# Altium schematic sheet OMODRI_QuadEnc.SchDoc
size A4
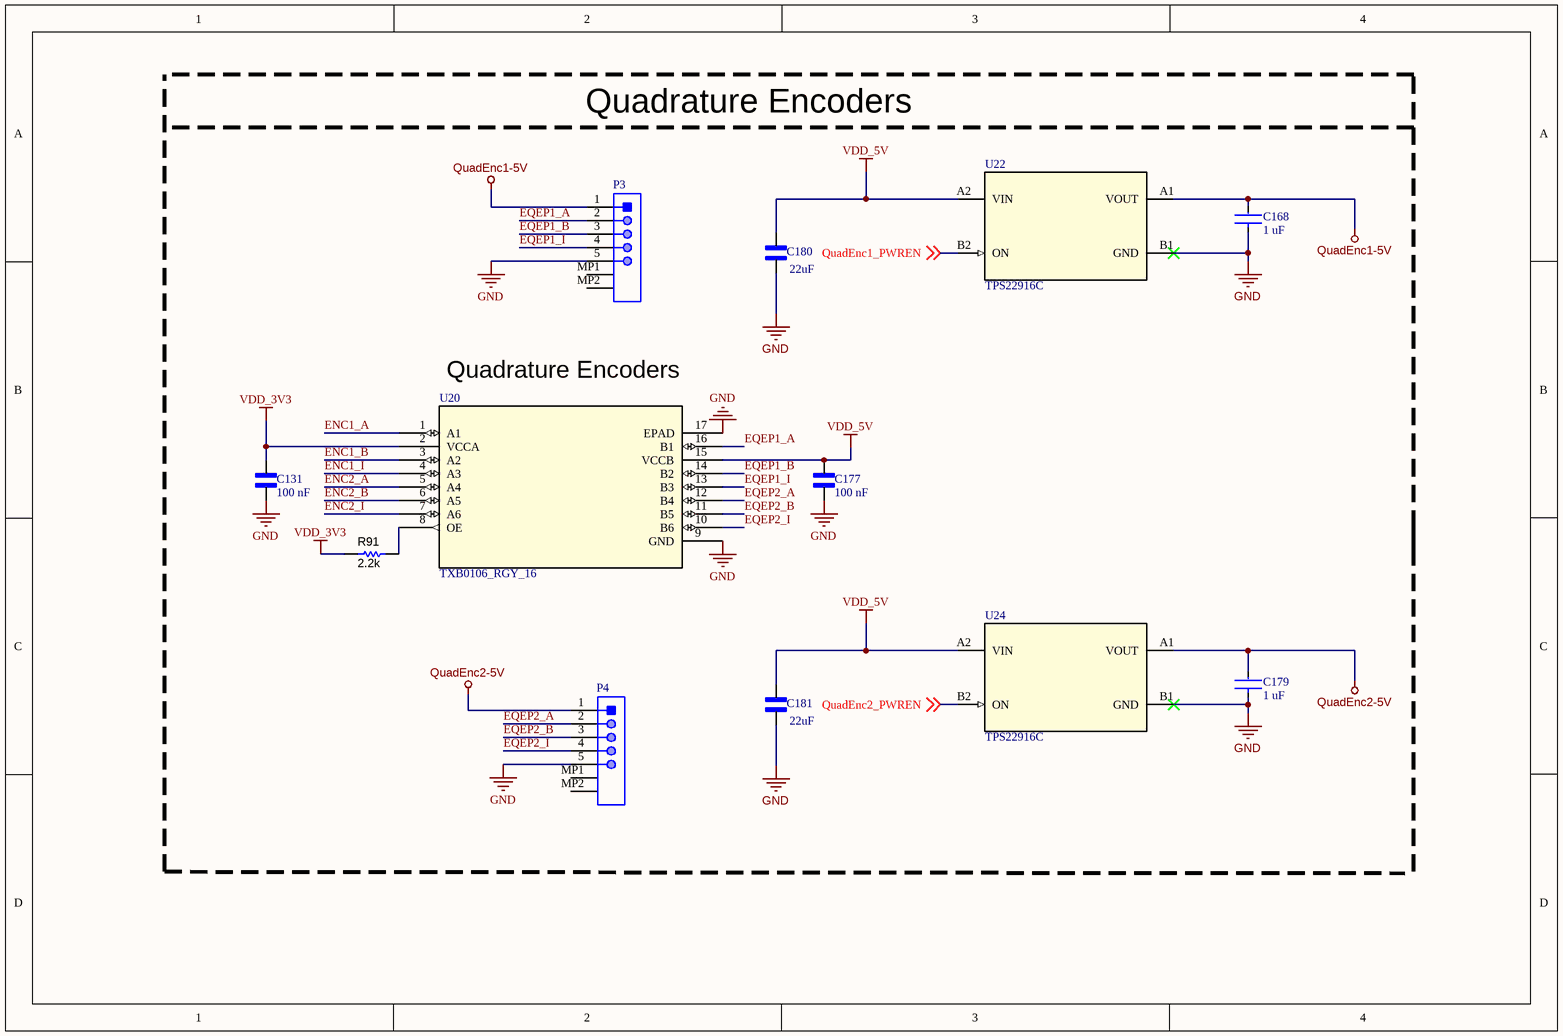
[diagram p0: OMODRI_QuadEnc.SchDoc]

## Parts
C131  value 100 nF  [CAPC0603X33N]  (hidden comment: GRM033R61E104KE14D)
C168  value 1 uF  [FP-CC0201-BA-MFG]  (hidden comment: CC0201MRX5R5BB105)
C177  value 100 nF  [CAPC0603X33N]  (hidden comment: GRM033R61E104KE14D)
C179  value 1 uF  [FP-CC0201-BA-MFG]  (hidden comment: CC0201MRX5R5BB105)
C180  value 22uF  [CAPC1005X55N]  (hidden comment: CL05A226MQ5N6J8)
C181  value 22uF  [CAPC1005X55N]  (hidden comment: CL05A226MQ5N6J8)
P3  BM05B-GHS-TBT(LF)(SN)  [JST-BM05B-GHS-TBT_V]  (value not drawn)
P4  BM05B-GHS-TBT(LF)(SN)  [JST-BM05B-GHS-TBT_V]  (value not drawn)
R91  ValueDisplayed: 2.2k  [0402]  (hidden comment: CRCW04022K20JNED)
U20  TXB0106_RGY_16  [RGY16_2P55X2P05]
U22  TPS22916C  [YFP0004ABAB]
U24  TPS22916C  [YFP0004ABAB]

## Nets
GND: C131.1 C168.1 C177.1 C179.1 C180.1 C181.1 P3.5 P4.5 U20.9(GND) U20.17(EPAD) U22.B1(GND) U24.B1(GND)
QuadEnc1-5V: C168.2 P3.1 U22.A1(VOUT)
QuadEnc2-5V: C179.2 P4.1 U24.A1(VOUT)
VDD_3V3: C131.2 R91.2 U20.2(VCCA)
VDD_5V: C177.2 C180.2 C181.2 U20.15(VCCB) U22.A2(VIN) U24.A2(VIN)
ENC1_A: U20.1(A1)
ENC1_B: U20.3(A2)
ENC1_I: U20.4(A3)
ENC2_A: U20.5(A4)
ENC2_B: U20.6(A5)
ENC2_I: U20.7(A6)
EQEP1_A: P3.2 U20.16(B1)
EQEP1_B: P3.3 U20.14(B2)
EQEP1_I: P3.4 U20.13(B3)
EQEP2_A: P4.2 U20.12(B4)
EQEP2_B: P4.3 U20.11(B5)
EQEP2_I: P4.4 U20.10(B6)
QuadEnc1_PWREN: U22.B2(ON) ; off-sheet QuadEnc1_PWREN
QuadEnc2_PWREN: U24.B2(ON) ; off-sheet QuadEnc2_PWREN
NetR91_1: R91.1 U20.8(OE)

Not connected (* = marked no-connect by the designer): P3 MP1 MP2; P4 MP1 MP2

## Notes on the sheet
- Quadrature Encoders

## Library data of the parts
C131 C177 = GRM033R61E104KE14D: SMD Capacitor X5R_EIA_ with Capacitance: 0.10uF Tol. 10%. Rated Voltage: 25Vdc; MF: Murata; SnapEDA_Link: https://www.snapeda.com/parts/GRM033R61E104KE14D/Murata/view-part/4375622/?ref=snap; Availability: Unavailable; MP: GRM033R61E104KE14D; Package: 0603 Taiyo Yuden; Price: None
C168 C179 = CMP-03422-000660-1: CAP CER 1UF 6.3V X5R 0201; Manufacturer: Yageo; Material: Ceramic; Tolerance: 0.2; Temperature Coefficient: 15%; Lead Free: Yes; Capacitance: 1 uF; ComponentLink2URL: http://www.yageo.com/documents/recent/UPY-GPHC_X5R_4V-to-50V_25.pdf; Footprint Url: http://www.yageo.com/exep/pages/download/literatures/UPY-C_GEN_24.pdf; Temperature Range Low: -55°C; Category: Cap; Device Class L3: Ceramic Capacitors; Device Class L2: Capacitors; Digikey Description: CAP CER 1UF 6.3V X5R 0201; Automotive: No; Temperature: -55°C to +85°C; RoHS: TRUE; Octopart: https://octopart.com/cc0201mrx5r5bb105-yageo-33242268; Height: 0.33mm; Temperature Range High: +85°C; Temperature Characteristic: X5R; Device Class L1: Passive Components; Package: CC0201-BA; ComponentLink2Description: Datasheet; Manufacturer Part Number: CC0201MRX5R5BB105; Voltage Rating: 6.3 V; Mouser Description: Multilayer Ceramic Capacitors MLCC - SMD/SMT 1.0uF 6.3V X5R 20%; Ipc Land Pattern Name: CAPC6030X30
C180 C181 = CL05A226MQ5N6J8: 22µF ±20% 6.3V Ceramic Capacitor X5R 0402 (1005 Metric); MF: Samsung Electro-Mechanics; Package: 0402 Samsung Electro-Mechanics; Availability: Unavailable; MP: CL05A226MQ5N6J8; DigiKey-Purchase-URL: https://snapeda.com/shop?store=DigiKey&id=3601912; SnapEDA_Link: https://www.snapeda.com/parts/CL05A226MQ5N6J8/Samsung%20Electro-Mechanics/view-part/3601912/?ref=snap; Price: None
P3 P4 = CMP-2000-05958-1: GH Disconnectable Crimp Style Connector, Pitch 1.25 mm, 1 x 5 Position, Height 4.05 mm, -25 to 85 degC, RoHS, Tape and Reel; Manufacturer: JST; No of Positions: 5; Pitch: 1.25mm; Style/Orientation: StraightHeader/Plug; Package Reference: BM05B-GHS-TBT; Type: WiretoBoard; Datasheet URL: http://www.jst-mfg.com/product/pdf/eng/eGH.pdf; Termination: Crimp; Manufacturer URL: http://www.jst.com/home2.html; Mounting Technology: SurfaceMount; Datasheet Version: 05/2016; Package Description: GH Disconnectable Crimp Style Connector, Pitch 1.25 mm, 1 x 5 Position, Height 4.05 mm
R91 = CMP-0026890-5: RES, 2.2 k, 5%, 0.063 W, AEC-Q200 Grade 0, 0402; Manufacturer: Vishay-Dale; Power_W: 63mW; TempCo: 200 ppm/C; Value_Code: 2k20; Value: 2.2k; EIA_Code: E24; SizeX_mm: 1; SizeY_mm: 0.5; SizeZ_mm: 0.6; Value2: 0.063W; AEC Qualified: Y; VDC_V: 50V; AEC Category: Q200; AEC Grade: 0; Supplier Part Number 2: 59M6710; Supplier 2: Newark; Supplier Part Number 3: 71-CRCW0402J-2.2K-E3; Supplier 3: Mouser; RoHS: E; Value1: 5%; MountType: SMT; Supplier 1: Digi-Key; PackageReference: 0402; Tolerance_%: 5%; Res_ohm: 2.2k; SizeArea_mm2: 0.5; CompType: Resistor; PartNumber: CRCW04022K20JNED; ComponentLink1Description: Datasheet link; Supplier Part Number 1: 541-2.2KJCT-ND; Technology: Thick Film; ComponentLink1URL: http://www.vishay.com/docs/20035/dcrcwe3.pdf
U20 = TXB0106_RGY_16: Vendor: Texas Instruments; PACKAGE_DESIGNATOR: RGY; PIN_COUNT: 16; FAMILY_NAME: AUTO DIRECTION SENSING DUAL SUPPLY TRANSLATOR; INDUSTRY_STD_PKG_TYPE: VQFN; Manufacturer_Part_Number: txb0106_rgy_16; GENERIC_PART_NUMBER: TXB0106; Manufacturer: Texas Instruments; Datasheet_URL: http://www.ti.com/lit/gpn/TXB0106; Value: Value; Type: Type; RefDes: RefDes
U22 U24 = TPS22916C: TPS22916CY Single-Channel Ultra-Low Leakage Load Switch 2A 60 mO 1V to 5.5V 4-Pin DSBGA T/R; Manufacturer: Texas Instruments; Manufacturer Part Number: TPS22916CYFPR; Number of Channels: 1; Fault Protection: Reverse Current; Output Configuration: High Side; Supplier 1: Digi-Key; RoHS: No; Stock 1: 2282; Pricing 1: 1=0,42000, 10=0,36400, 25=0,33960, 100=0,25220, 250=0,21340, 500=0,20370, 1000=0,15035 (USD); Min Operating Temperature: -40°C; Max Operating Temperature: 85°C; Packaging: Tape and Reel; Number of Outputs: 1; Max Output Current: 2A; ComponentLink1URL: http://www.ti.com/lit/ds/symlink/tps22916.pdf?src-supplier=Digi-Key; ComponentLink1Description: http://www.ti.com/lit/ds/symlink/tps22916.pdf?src-supplier=Digi-Key; Supplier Part Number 1: 296-50065-1-ND